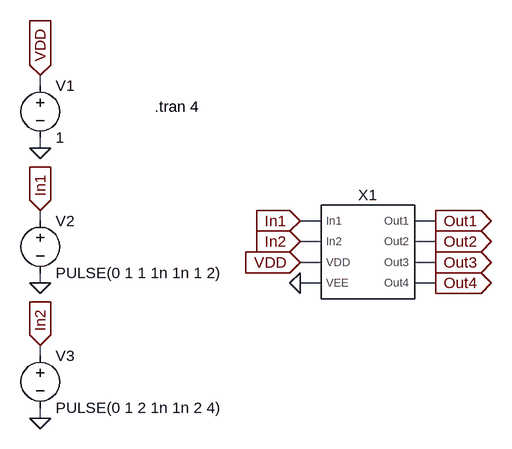
[diagram p0: schematic 2_to_4_Decoder_Symbol_Test.asc]
2_to_4_Decoder_Symbol_Test.asc, the LTspice schematic file:
Version 4
SHEET 1 880 680
WIRE 48 80 48 64
WIRE 48 176 48 160
WIRE 48 288 48 272
WIRE 480 288 448 288
WIRE 656 288 624 288
WIRE 480 320 448 320
WIRE 656 320 624 320
WIRE 480 352 448 352
WIRE 656 352 624 352
WIRE 48 384 48 368
WIRE 480 384 448 384
WIRE 656 384 624 384
WIRE 48 496 48 480
WIRE 48 592 48 576
FLAG 48 592 0
FLAG 48 384 0
FLAG 48 176 0
FLAG 48 64 VDD
IOPIN 48 64 In
FLAG 448 352 VDD
IOPIN 448 352 In
FLAG 448 384 0
FLAG 48 272 In1
IOPIN 48 272 In
FLAG 448 288 In1
IOPIN 448 288 In
FLAG 48 480 In2
IOPIN 48 480 In
FLAG 448 320 In2
IOPIN 448 320 In
FLAG 656 288 Out1
IOPIN 656 288 Out
FLAG 656 320 Out2
IOPIN 656 320 Out
FLAG 656 352 Out3
IOPIN 656 352 Out
FLAG 656 384 Out4
IOPIN 656 384 Out
SYMBOL 2_to_4_Decoder_Symbol 544 336 R0
SYMATTR InstName X1
SYMBOL Voltage 48 64 R0
SYMATTR InstName V1
SYMATTR Value 1
SYMBOL Voltage 48 272 R0
SYMATTR InstName V2
SYMATTR Value PULSE(0 1 1 1n 1n 1 2)
SYMBOL Voltage 48 480 R0
SYMATTR InstName V3
SYMATTR Value PULSE(0 1 2 1n 1n 2 4)
TEXT 224 112 Left 2 !.tran 4

The netlist it stands for:
* 2_to_4_Decoder_Symbol_Test.asc
XX1 In1 In2 VDD 0 Out1 Out2 Out3 Out4 2_to_4_Decoder_Symbol  ; pins In1 In2 VDD VEE Out1 Out2 Out3 Out4
V1 VDD 0 1
V2 In1 0 PULSE(0 1 1 1n 1n 1 2)
V3 In2 0 PULSE(0 1 2 1n 1n 2 4)
.tran 4
.backanno
.end